# Altium schematic sheet Pinboard.schdoc
size 124 x 117 mm
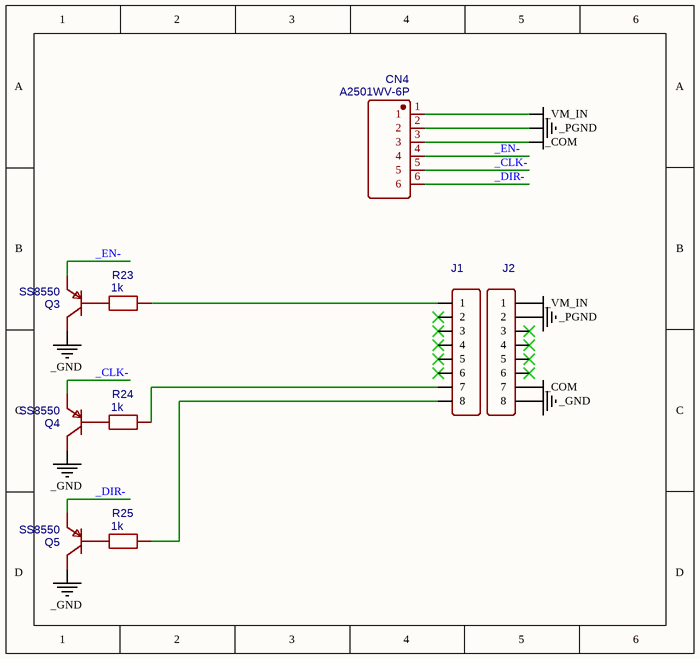
[diagram p0: Pinboard.schdoc]

## Parts
CN4  A2501WV-6P  [CONN-TH_A2501WV-6P]
J1  HDR-M-2.54_1x8  [HDR-M-2.54_1X8]  (value not drawn)
J2  HDR-M-2.54_1x8  [HDR-M-2.54_1X8]  (value not drawn)
Q3  SS8550  [SOT-23-3_L2.9-W1.3-P1.90-LS2.4-BR]
Q4  SS8550  [SOT-23-3_L2.9-W1.3-P1.90-LS2.4-BR]
Q5  SS8550  [SOT-23-3_L2.9-W1.3-P1.90-LS2.4-BR]
R23  1k  [R0603_SMALL]
R24  1k  [R0603_SMALL]
R25  1k  [R0603_SMALL]

## Nets
_COM: CN4.3 J2.7
_GND: J2.8 Q3.3(C) Q4.3(C) Q5.3(C)
_PGND: CN4.2 J2.2
_VM_IN: CN4.1 J2.1
_CLK-: CN4.5 Q4.2(E)
_DIR-: CN4.6 Q5.2(E)
_EN-: CN4.4 Q3.2(E)
NetJ1_1: J1.1 R23.2
NetJ1_7: J1.7 R24.2
NetJ1_8: J1.8 R25.2
NetQ3_1: Q3.1(B) R23.1
NetQ4_1: Q4.1(B) R24.1
NetQ5_1: Q5.1(B) R25.1

Not connected (* = marked no-connect by the designer): J1 2* 3* 4* 5* 6*; J2 3* 4* 5* 6*

## Library data of the parts
CN4 = A2501WV-6P: BOM_Manufacturer: Changjiang Connectors; Contributor: LCSC; BOM_Supplier: LCSC; BOM_Supplier Part: C225392; BOM_Manufacturer Part: A2501WV-6P; BOM_JLCPCB Part Class: Extended Part; spicePre: C; spiceSymbolName: A2501WV-6P
J1 J2 = HDR-M-2.54_1x8: Contributor: LCEDA_Lib; BOM_Supplier Part: C190820; BOM_Supplier: LCSC; spicePre: J; spiceSymbolName: HDR-M-2.54_1x8
Q3-Q5 = SS8550: BOM_Manufacturer: 晶导微电子; Contributor: LCSC; BOM_Supplier: LCSC; BOM_Supplier Part: C2762207; BOM_Manufacturer Part: SS8550; BOM_JLCPCB Part Class: Extended Part; spicePre: Q; spiceSymbolName: SS8550_C2762207
R23-R25 = 1k: BOM_Manufacturer Part: 0603WAF1001T5E; BOM_Manufacturer: UniOhm; nameAlias: Value(Ω); Contributor: LCEDA_Lib; BOM_Supplier Part: C21190; BOM_Supplier: LCSC; spicePre: R; spiceSymbolName: R_0603_EU